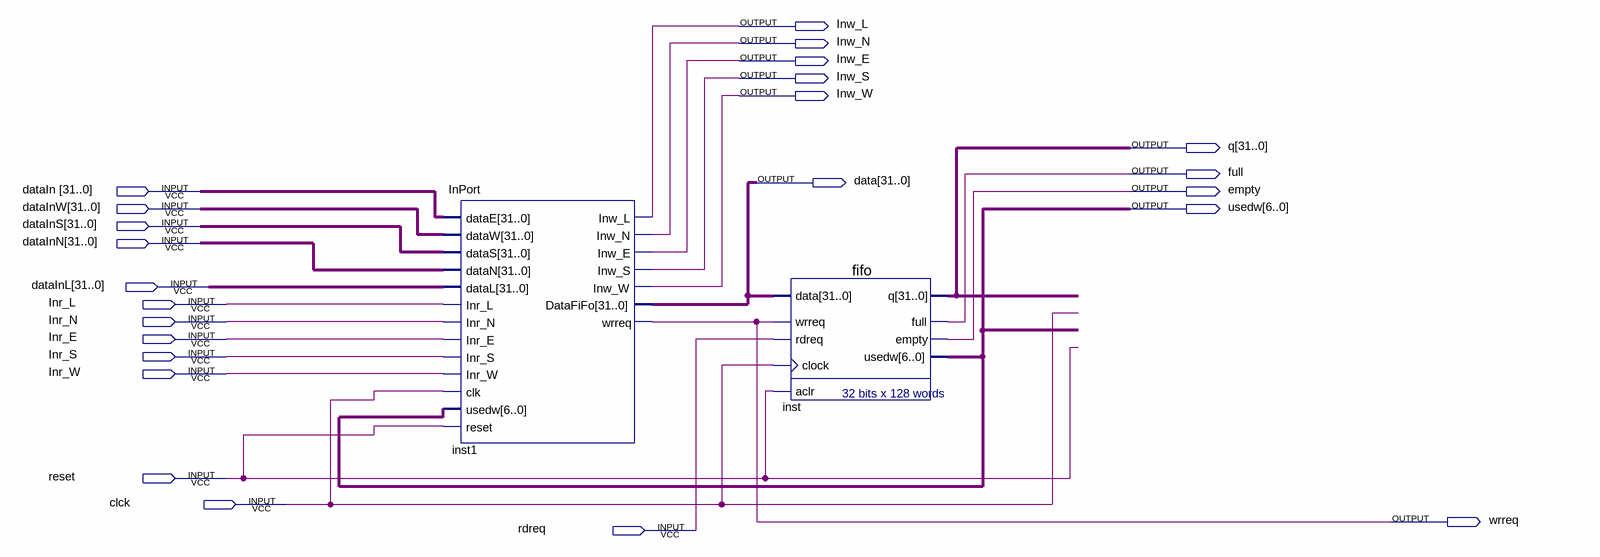
[diagram p0: schematic sheet]
// Quartus schematic NoCSimp3_m.bdf as structural Verilog: 2 symbols, 24 pins
module NoCSimp3_m (
  input  [31:0] dataIn,
  input  [31:0] dataInW,
  input  [31:0] dataInS,
  input  [31:0] dataInN,
  input  [31:0] dataInL,
  input  Inr_L,
  input  Inr_N,
  input  Inr_E,
  input  Inr_S,
  input  Inr_W,
  input  reset,
  input  clck,
  input  rdreq,
  output Inw_L,
  output Inw_N,
  output Inw_E,
  output Inw_S,
  output Inw_W,
  output [31:0] q,
  output full,
  output [31:0] data,
  output empty,
  output [6:0] usedw,
  output wrreq
);

  InPort inst1 (
    .dataE(dataIn), .dataW(dataInW), .dataS(dataInS), .dataN(dataInN), .dataL(dataInL), .Inr_L(Inr_L),
    .Inr_N(Inr_N), .Inr_E(Inr_E), .Inr_S(Inr_S), .Inr_W(Inr_W), .clk(clck), .usedw(usedw), .reset(reset),
    .Inw_L(Inw_L), .Inw_N(Inw_N), .Inw_E(Inw_E), .Inw_S(Inw_S), .Inw_W(Inw_W), .DataFiFo(data), .wrreq(wrreq));
  fifo inst (
    .data(data), .wrreq(wrreq), .rdreq(rdreq), .clock(clck), .aclr(reset), .q(q), .full(full), .empty(empty),
    .usedw(usedw));
endmodule
